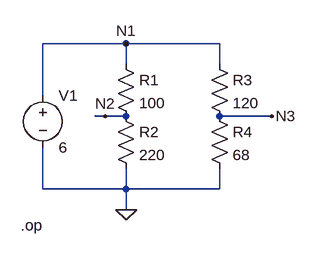
[diagram p0: schematic lab2.asc]
lab2.asc, the LTspice schematic file:
Version 4
SHEET 1 880 680
WIRE 208 48 80 48
WIRE 352 48 208 48
WIRE 208 80 208 48
WIRE 352 80 352 48
WIRE 80 128 80 48
WIRE 176 160 160 160
WIRE 208 160 176 160
WIRE 432 160 352 160
WIRE 80 272 80 208
WIRE 208 272 208 240
WIRE 208 272 80 272
WIRE 352 272 352 240
WIRE 352 272 208 272
WIRE 208 304 208 272
FLAG 208 48 N1
FLAG 176 160 N2
FLAG 432 160 N3
FLAG 208 304 0
SYMBOL voltage 80 112 R0
WINDOW 123 0 0 Left 0
WINDOW 39 0 0 Left 0
SYMATTR InstName V1
SYMATTR Value 6
SYMBOL res 192 64 R0
SYMATTR InstName R1
SYMATTR Value 100
SYMBOL res 192 144 R0
SYMATTR InstName R2
SYMATTR Value 220
SYMBOL res 336 64 R0
SYMATTR InstName R3
SYMATTR Value 120
SYMBOL res 336 144 R0
SYMATTR InstName R4
SYMATTR Value 68
TEXT 46 328 Left 2 !.op

The netlist it stands for:
* lab2.asc
V1 N1 0 6
R1 N1 N2 100
R2 N2 0 220
R3 N1 N3 120
R4 N3 0 68
.op
.backanno
.end

* Results of the author's LTspice run, read from the files saved beside the schematic
* Operating Point:
*   V(n1) = 6 V
*   V(n2) = 4.125 V
*   V(n3) = 2.17 V
*   I(R4) = 31.91 mA
*   I(R3) = 31.91 mA
*   I(R2) = 18.75 mA
*   I(R1) = 18.75 mA
*   I(V1) = -50.66 mA